# EAGLE schematic AS3364 bus mixer v2.0 (EAGLE 9.6.2)
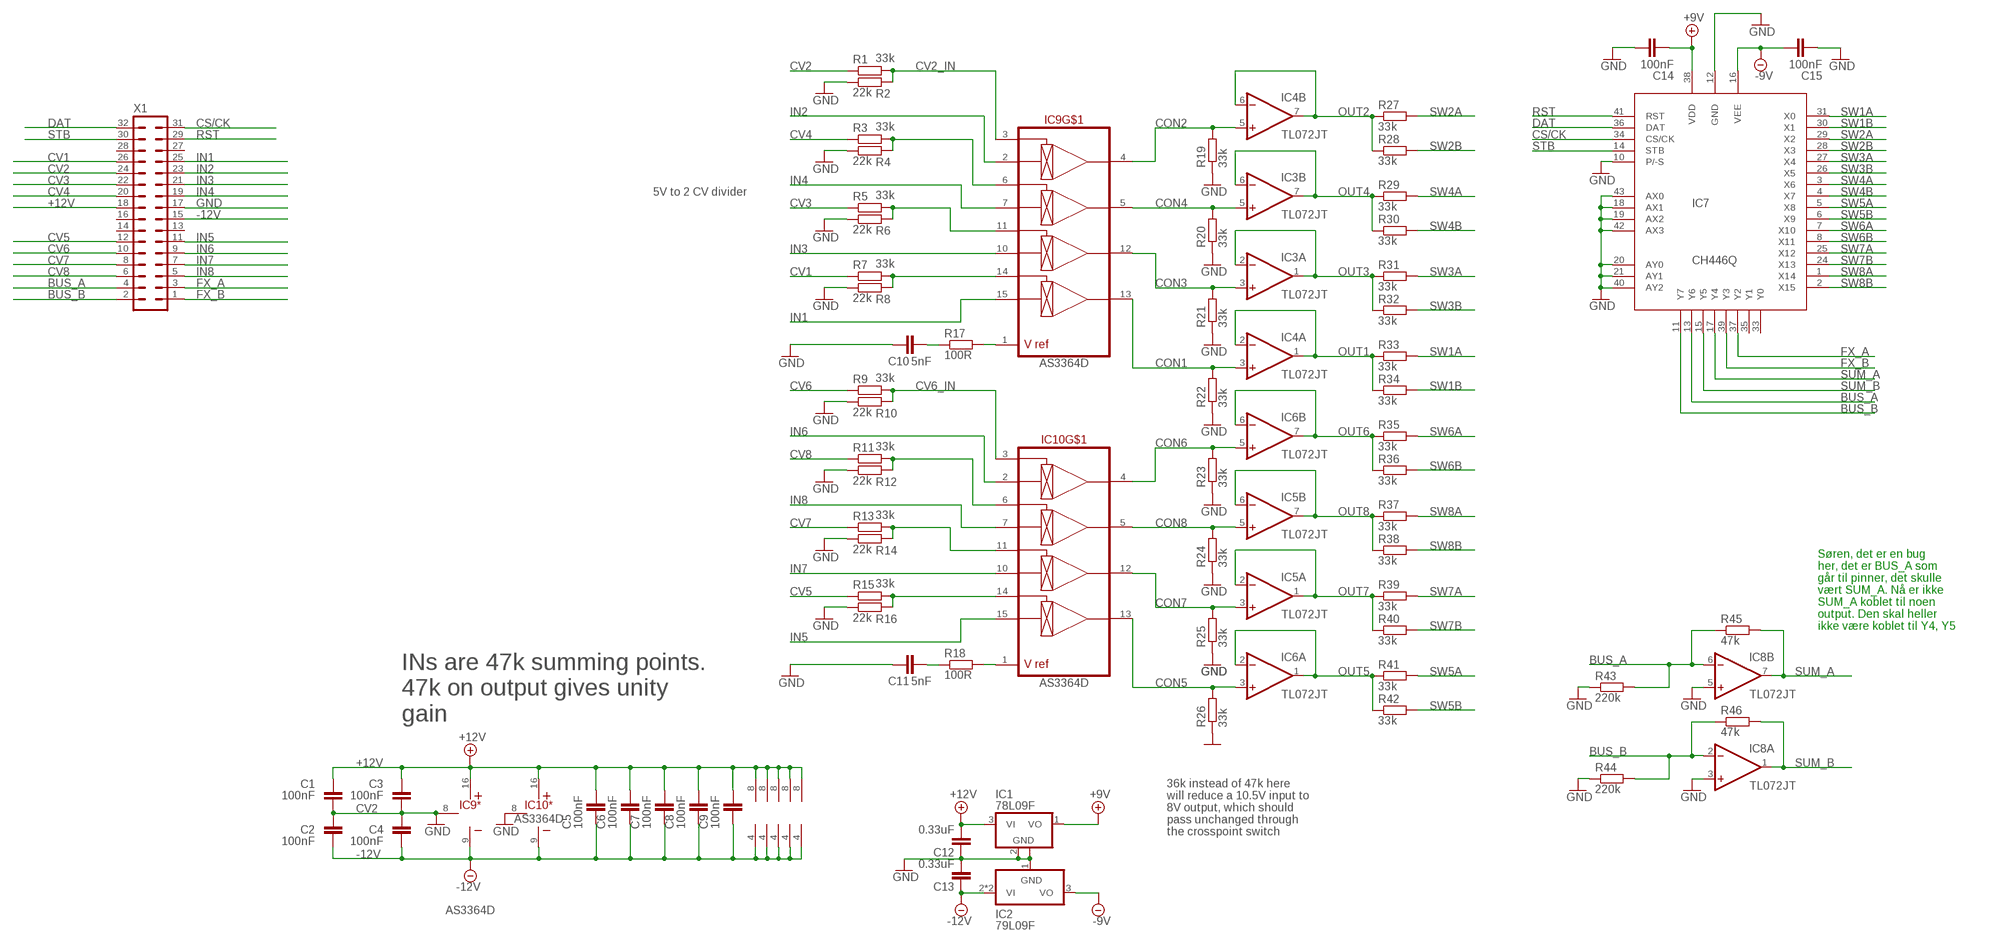
[diagram p0: schematic, sheet 1]

## Parts
C1  100nF  C-EUC0402  [C0402]
C2  100nF  C-EUC0402  [C0402]
C3  100nF  C-EUC0402  [C0402]
C4  100nF  C-EUC0402  [C0402]
C5  100nF  C-EUC0402  [C0402]
C6  100nF  C-EUC0402  [C0402]
C7  100nF  C-EUC0402  [C0402]
C8  100nF  C-EUC0402  [C0402]
C9  100nF  C-EUC0402  [C0402]
C10  5nF  C-EUC0402  [C0402]
C11  5nF  C-EUC0402  [C0402]
C12  0.33uF  C-EUC0603  [C0603]
C13  0.33uF  C-EUC0603  [C0603]
C14  100nF  C-EUC0402  [C0402]
C15  100nF  C-EUC0402  [C0402]
IC1  78L09F  [SOT89]
IC2  79L09F  [SOT89]
IC3  TL072JT  [TSSOP8J]
IC4  TL072JT  [TSSOP8J]
IC5  TL072JT  [TSSOP8J]
IC6  TL072JT  [TSSOP8J]
IC7  CH446Q  [LQFP-44-J]
IC8  TL072JT  [TSSOP8J]
IC9  AS3364D  [DIL16J]
IC10  AS3364D  [DIL16J]
R1  33k  R-EU_R0402  [R0402]
R2  22k  R-EU_R0402  [R0402]
R3  33k  R-EU_R0402  [R0402]
R4  22k  R-EU_R0402  [R0402]
R5  33k  R-EU_R0402  [R0402]
R6  22k  R-EU_R0402  [R0402]
R7  33k  R-EU_R0402  [R0402]
R8  22k  R-EU_R0402  [R0402]
R9  33k  R-EU_R0402  [R0402]
R10  22k  R-EU_R0402  [R0402]
R11  33k  R-EU_R0402  [R0402]
R12  22k  R-EU_R0402  [R0402]
R13  33k  R-EU_R0402  [R0402]
R14  22k  R-EU_R0402  [R0402]
R15  33k  R-EU_R0402  [R0402]
R16  22k  R-EU_R0402  [R0402]
R17  100R  R-EU_R0402  [R0402]
R18  100R  R-EU_R0402  [R0402]
R19  33k  R-EU_R0402  [R0402]
R20  33k  R-EU_R0402  [R0402]
R21  33k  R-EU_R0402  [R0402]
R22  33k  R-EU_R0402  [R0402]
R23  33k  R-EU_R0402  [R0402]
R24  33k  R-EU_R0402  [R0402]
R25  33k  R-EU_R0402  [R0402]
R26  33k  R-EU_R0402  [R0402]
R27  33k  R-EU_R0402  [R0402]
R28  33k  R-EU_R0402  [R0402]
R29  33k  R-EU_R0402  [R0402]
R30  33k  R-EU_R0402  [R0402]
R31  33k  R-EU_R0402  [R0402]
R32  33k  R-EU_R0402  [R0402]
R33  33k  R-EU_R0402  [R0402]
R34  33k  R-EU_R0402  [R0402]
R35  33k  R-EU_R0402  [R0402]
R36  33k  R-EU_R0402  [R0402]
R37  33k  R-EU_R0402  [R0402]
R38  33k  R-EU_R0402  [R0402]
R39  33k  R-EU_R0402  [R0402]
R40  33k  R-EU_R0402  [R0402]
R41  33k  R-EU_R0402  [R0402]
R42  33k  R-EU_R0402  [R0402]
R43  220k  R-EU_R0402  [R0402]
R44  220k  R-EU_R0402  [R0402]
R45  47k  R-EU_R0402  [R0402]
R46  47k  R-EU_R0402  [R0402]
X1  MA16-2WJ  [MA16-2WJ]

## Nets
+9V: C14.1 IC1.1(VO) IC7.38(VDD)
+12V: C1.2 C3.2 C5.2 C6.2 C7.2 C8.2 C9.2 C12.2 IC1.3(VI) IC3.8(P:V+) IC4.8(P:V+) IC5.8(P:V+) IC6.8(P:V+) IC8.8(P:V+) IC9.16(*:V+) IC10.16(*:V+) X1.18
-9V: C15.2 IC2.3(VO) IC7.16(VEE)
-12V: C2.1 C4.1 C5.1 C6.1 C7.1 C8.1 C9.1 C13.1 IC2.2(VI) IC2.2@1(VI) IC3.4(P:V-) IC4.4(P:V-) IC5.4(P:V-) IC6.4(P:V-) IC8.4(P:V-) IC9.9(*:V-) IC10.9(*:V-) X1.15
BUS_A: IC7.13(Y6) IC8.6(B:-IN) R43.2 R45.1 X1.4
BUS_B: IC7.11(Y7) IC8.2(A:-IN) R44.2 R46.1 X1.2
CON1: IC4.3(A:+IN) IC9.13(OUT4) R22.2
CON2: IC4.5(B:+IN) IC9.4(OUT1) R19.2
CON3: IC3.3(A:+IN) IC9.12(OUT3) R21.2
CON4: IC3.5(B:+IN) IC9.5(OUT2) R20.2
CON5: IC6.3(A:+IN) IC10.13(OUT4) R26.2
CON6: IC6.5(B:+IN) IC10.4(OUT1) R23.2
CON7: IC5.3(A:+IN) IC10.12(OUT3) R25.2
CON8: IC5.5(B:+IN) IC10.5(OUT2) R24.2
CS/CK: IC7.34(CS/CK) X1.31
CV1: R7.1 X1.26
CV2: R1.1 X1.24
CV2_IN: IC9.3(CV1) R1.2 R2.2
CV3: R5.1 X1.22
CV4: R3.1 X1.20
CV5: R15.1 X1.12
CV6: R9.1 X1.10
CV6_IN: IC10.3(CV1) R9.2 R10.2
CV7: R13.1 X1.8
CV8: R11.1 X1.6
DAT: IC7.36(DAT) X1.32
FX_A: IC7.37(Y2) X1.3
FX_B: IC7.39(Y3) X1.1
GND: C1.1 C2.2 C3.1 C4.2 C10.1 C11.1 C12.1 C13.2 C14.2 C15.1 IC1.2(GND) IC1.2@1(GND) IC2.1(GND) IC7.10(P/-S) IC7.12(GND) IC7.18(AX1) IC7.19(AX2) IC7.20(AY0) IC7.21(AY1) IC7.40(AY2) IC7.42(AX3) IC7.43(AX0) IC8.3(A:+IN) IC8.5(B:+IN) IC9.8(*:GND) IC10.8(*:GND) R2.1 R4.1 R6.1 R8.1 R10.1 R12.1 R14.1 R16.1 R19.1 R20.1 R21.1 R22.1 R23.1 R24.1 R25.1 R26.1 R43.1 R44.1 X1.17
IN1: IC9.15(IN4) X1.25
IN2: IC9.2(IN1) X1.23
IN3: IC9.10(IN3) X1.21
IN4: IC9.7(IN2) X1.19
IN5: IC10.15(IN4) X1.11
IN6: IC10.2(IN1) X1.9
IN7: IC10.10(IN3) X1.7
IN8: IC10.7(IN2) X1.5
N$1: IC10.1(VREF) R18.2
N$2: IC9.1(VREF) R17.2
N$3: IC10.6(CV2) R11.2 R12.2
N$5: IC10.11(CV3) R13.2 R14.2
N$7: IC10.14(CV4) R15.2 R16.2
N$8: C11.2 R18.1
N$10: IC9.6(CV2) R3.2 R4.2
N$12: IC9.11(CV3) R5.2 R6.2
N$14: C10.2 R17.1
N$21: IC9.14(CV4) R7.2 R8.2
OUT1: IC4.1(A:OUT) IC4.2(A:-IN) R33.1 R34.1
OUT2: IC4.6(B:-IN) IC4.7(B:OUT) R27.1 R28.1
OUT3: IC3.1(A:OUT) IC3.2(A:-IN) R31.1 R32.1
OUT4: IC3.6(B:-IN) IC3.7(B:OUT) R29.1 R30.1
OUT5: IC6.1(A:OUT) IC6.2(A:-IN) R41.1 R42.1
OUT6: IC6.6(B:-IN) IC6.7(B:OUT) R35.1 R36.1
OUT7: IC5.1(A:OUT) IC5.2(A:-IN) R39.1 R40.1
OUT8: IC5.6(B:-IN) IC5.7(B:OUT) R37.1 R38.1
RST: IC7.41(RST) X1.29
STB: IC7.14(STB) X1.30
SUM_A: IC7.17(Y4) IC8.7(B:OUT) R45.2
SUM_B: IC7.15(Y5) IC8.1(A:OUT) R46.2
SW1A: IC7.31(X0) R33.2
SW1B: IC7.30(X1) R34.2
SW2A: IC7.29(X2) R27.2
SW2B: IC7.28(X3) R28.2
SW3A: IC7.27(X4) R31.2
SW3B: IC7.26(X5) R32.2
SW4A: IC7.3(X6) R29.2
SW4B: IC7.4(X7) R30.2
SW5A: IC7.5(X8) R41.2
SW5B: IC7.6(X9) R42.2
SW6A: IC7.7(X10) R35.2
SW6B: IC7.8(X11) R36.2
SW7A: IC7.25(X12) R39.2
SW7B: IC7.24(X13) R40.2
SW8A: IC7.1(X14) R37.2
SW8B: IC7.2(X15) R38.2
Unconnected: IC7.33(Y0) IC7.35(Y1) X1.13 X1.14 X1.16 X1.27 X1.28

## Notes on the sheet
- 5V to 2 CV divider
- Søren, det er en bug
  her, det er BUS_A som 
  går til pinner, det skulle
  vært SUM_A. Nå er ikke
  SUM_A koblet til noen
  output. Den skal heller
  ikke være koblet til Y4, Y5
- INs are 47k summing points.
  47k on output gives unity
  gain
- 36k instead of 47k here 
  will reduce a 10.5V input to
  8V output, which should
  pass unchanged through
  the crosspoint switch

## Library data of the parts
C1-C11 C14 C15 = rcl:C-EU: CAPACITOR, European symbol; SPICEPREFIX: C
C12 C13 = resistor:C-EU: CAPACITOR, European symbol
IC1 = linear:78L*: POSITOIV-VOLTAGE REGULATORS Output up to 100 mA Source: Datasheet <http://focus.ti.com/lit/ds/symlink/ua78l05.pdf>
IC2 = joakim:79L*: NEGATIVE-VOLTAGE REGULATORS Output up to 100 mA
IC3-IC6 IC8 = joakim:TL072J: OP AMP
IC7 = joakim:CH446Q: 8x16 matrix analog switch chip, contains 128 analog switches, used for arbitrary routing of 8x16 signal channels. CH446 supports 4V to 12V single supply voltage, and supports +5V and -7V dual power supply voltage. The ON resistance is not greater than 65Ω. https://www.wch-ic.com/downloads/CH446DS1_PDF.html
IC9 IC10 = joakim:AS3364: AS3364 quad linear VCA, CEM3360 style. CV is 0 to 2V Vcc-Vee = 26V max, so +/-12V or +15V/-9V
R1-R46 = rcl:R-EU_: RESISTOR, European symbol; SPICEPREFIX: R
X1 = joakim:MA16-2WJ: PIN HEADER; OC_FARNELL: unknown; OC_NEWARK: unknown